# Altium project Wideband.PrjPCB
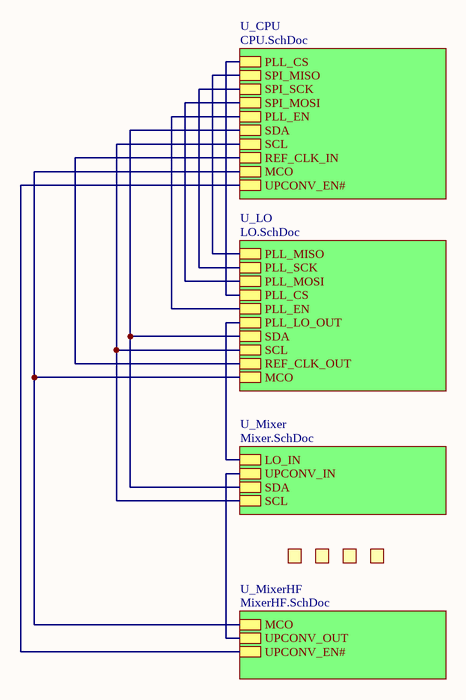
[diagram p0: Toplevel.SchDoc]
5 sheets, 175 parts. Net scope: hierarchical (ports join the sheet entries above them; power ports are global).
Board file: PCB.PcbDoc
Sheets:
  Toplevel.SchDoc
    U_CPU = CPU.SchDoc
    U_Mixer = Mixer.SchDoc
    U_MixerHF = MixerHF.SchDoc
    U_LO = LO.SchDoc

## Sheet Toplevel.SchDoc
size A4

### Parts
H1  MOUNTHOLE_3MM  [MOUNT_3MM]  (value not drawn)
H2  MOUNTHOLE_3MM  [MOUNT_3MM]  (value not drawn)
H3  MOUNTHOLE_3MM  [MOUNT_3MM]  (value not drawn)
H4  MOUNTHOLE_3MM  [MOUNT_3MM]  (value not drawn)

### Sub-sheets
U_CPU = CPU.SchDoc: PLL_CS, SPI_MISO, SPI_SCK, SPI_MOSI, PLL_EN, SDA, SCL, REF_CLK_IN, MCO, UPCONV_EN#
U_LO = LO.SchDoc: PLL_MISO, PLL_SCK, PLL_MOSI, PLL_CS, PLL_EN, PLL_LO_OUT, SDA, SCL, REF_CLK_OUT, MCO
U_Mixer = Mixer.SchDoc: LO_IN, UPCONV_IN, SDA, SCL
U_MixerHF = MixerHF.SchDoc: MCO, UPCONV_OUT, UPCONV_EN#

### Nets
CS_PLL: sheet U_CPU/PLL_CS, sheet U_LO/PLL_CS
LO+: sheet U_Mixer/LO_IN, sheet U_LO/PLL_LO_OUT
MOSI: sheet U_CPU/SPI_MOSI, sheet U_LO/PLL_MOSI
MUXOUT: sheet U_CPU/SPI_MISO, sheet U_LO/PLL_MISO
SCK: sheet U_CPU/SPI_SCK, sheet U_LO/PLL_SCK
SCL: sheet U_CPU/SCL, sheet U_Mixer/SCL, sheet U_LO/SCL
SDA: sheet U_CPU/SDA, sheet U_Mixer/SDA, sheet U_LO/SDA
NetC77_2: sheet U_Mixer/UPCONV_IN, sheet U_MixerHF/UPCONV_OUT
NetC83_2: sheet U_CPU/MCO, sheet U_MixerHF/MCO, sheet U_LO/MCO
NetR6_7: sheet U_CPU/PLL_EN, sheet U_LO/PLL_EN
NetR18_2: sheet U_CPU/REF_CLK_IN, sheet U_LO/REF_CLK_OUT
NetR33_1: sheet U_CPU/UPCONV_EN#, sheet U_MixerHF/UPCONV_EN#

## Sheet CPU.SchDoc
size A4
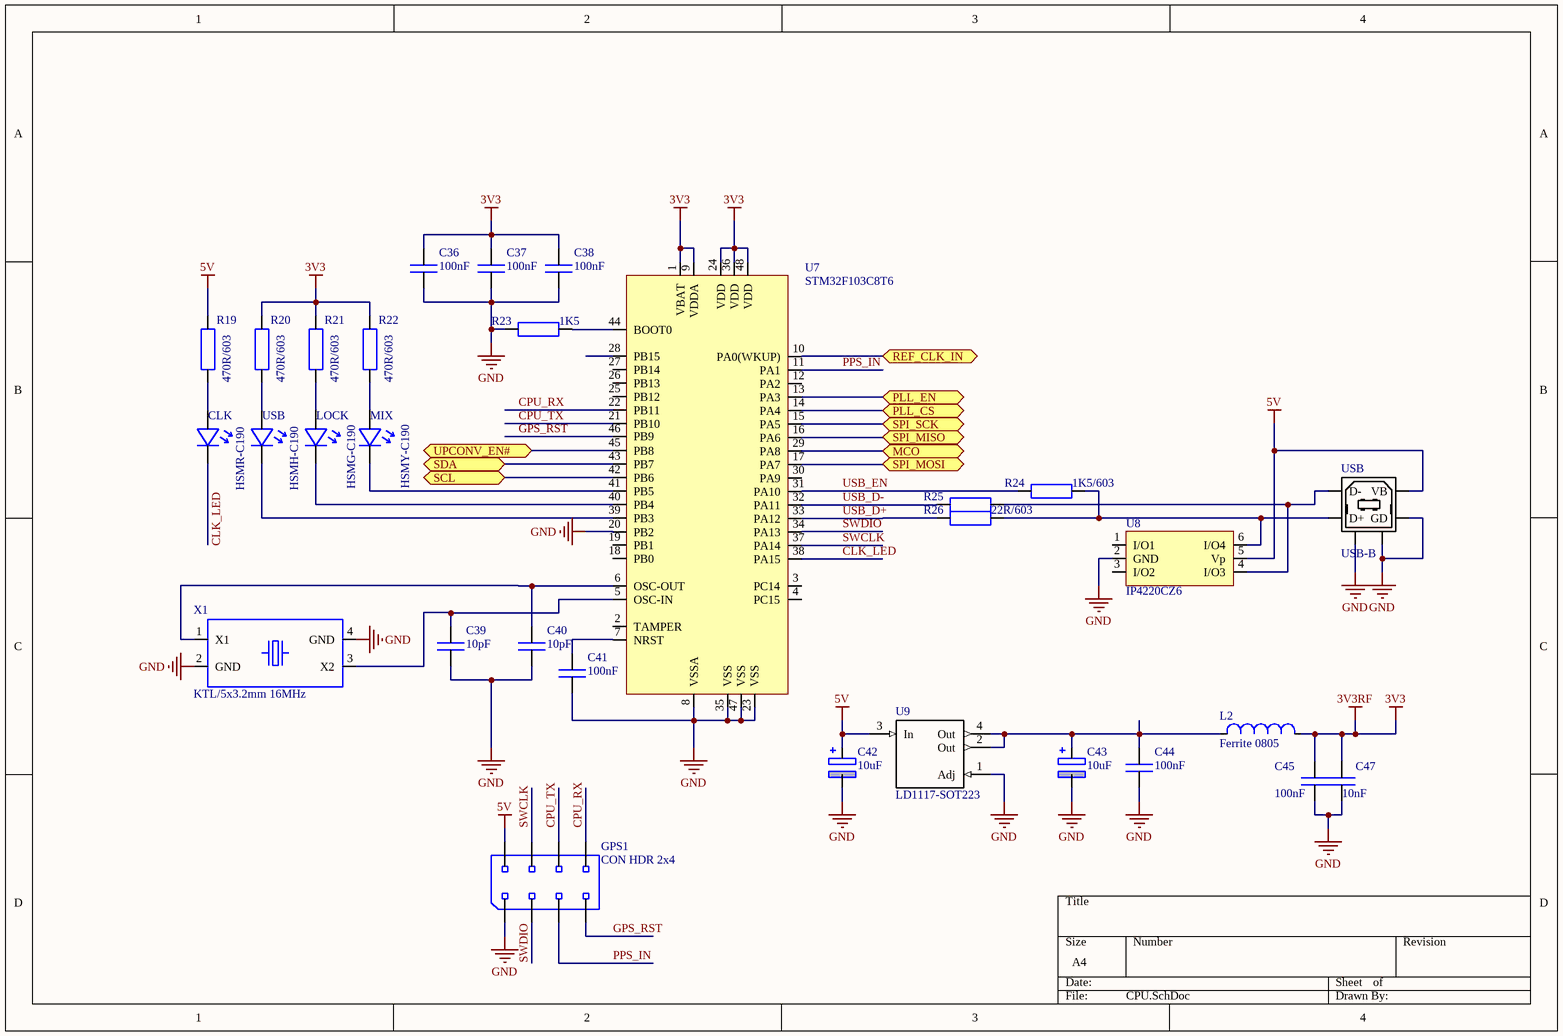
[diagram p1: CPU.SchDoc]

### Parts
(Parts that share a designator on the sheet are numbered #1, #2 ... from top to bottom, then left to right.)
C36  100nF  [smd C0603_0.80]
C37  100nF  [smd C0603_0.80]
C38  100nF  [smd C0603_0.80]
C39  10pF  [smd C0603_0.80]
C40  10pF  [smd C0603_0.80]
C41  100nF  [smd C0603_0.80]
C42  10uF  [smd C1206 polar]
C43  10uF  [smd C1206 polar]
C44  100nF  [smd C0603_0.80]
C45  100nF  [smd C0603_0.80]
C47  10nF  [smd C0603_0.80]
CLK  HSMR-C190  [led HSMH-C190 (Avago Technologies)]
GPS1  CON HDR 2x4  [hdr 2x4]
L2  Ferrite 0805  [smd C0805]
LOCK  HSMG-C190  [led HSMH-C190 (Avago Technologies)]
MIX  HSMY-C190  [led HSMH-C190 (Avago Technologies)]
R19  470R/603  [smd C0603_0.45]
R20  470R/603  [smd C0603_0.45]
R21  470R/603  [smd C0603_0.45]
R22  470R/603  [smd C0603_0.45]
R23  1K5  [smd C0603_0.45]
R24  1K5/603  [smd C0603_0.45]
R25  22R/603  [smd C0603_0.45]  (value not drawn)
R26  22R/603  [smd C0603_0.45]
U7  STM32F103C8T6  [TSQFP50P900X900X160-48N]
U8  IP4220CZ6  [smd SOT-457]
U9  LD1117-SOT223  [SOT223]
USB#1  HSMH-C190  [led HSMH-C190 (Avago Technologies)]
USB#2  USB-B  [USB-B]
X1#1  KTL/5x3.2mm 16MHz  [smd KTL 5x3.2]

### Ports
MCO, PLL_CS, PLL_EN, REF_CLK_IN, SCL, SDA, SPI_MISO, SPI_MOSI, SPI_SCK, UPCONV_EN#

### Nets
3V3: C36.2 C37.2 C38.2 C45.2 C47.2 L2.2 R20.2 R21.2 R22.2 U7.1(VBAT) U7.9(VDDA) U7.24(VDD) U7.36(VDD) U7.48(VDD)  [also labelled 3V3RF]
5V: C42.1 GPS1.2 R19.2 U8.5(Vp) U9.3(In) USB#2.1(VB)
GND: C36.1 C37.1 C38.1 C39.1 C40.1 C41.1 C42.2 C43.2 C44.1 C45.1 C47.1 GPS1.1 R23.1 U7.8(VSSA) U7.20(PB2) U7.23(VSS) U7.35(VSS) U7.47(VSS) U8.2(GND) U9.1(Adj) USB#2.4(GD) USB#2.5 USB#2.6 X1#1.2(GND) X1#1.4(GND)
CLK_LED: CLK.2 U7.38(PA15)
CPU_RX: GPS1.8 U7.22(PB11)
CPU_TX: GPS1.6 U7.21(PB10)
CS_PLL: U7.14(PA4) ; port PLL_CS
GPS_RST: GPS1.7 U7.46(PB9)
MOSI: U7.17(PA7) ; port SPI_MOSI
MUXOUT: U7.16(PA6) ; port SPI_MISO
PPS_IN: GPS1.5 U7.11(PA1)
SCK: U7.15(PA5) ; port SPI_SCK
SCL: U7.42(PB6) ; port SCL
SDA: U7.43(PB7) ; port SDA
SWCLK: GPS1.4 U7.37(PA14)
SWDIO: GPS1.3 U7.34(PA13)
USB_D+: R26.1 U7.33(PA12)
USB_D-: R25.1 U7.32(PA11)
USB_EN: R24.1 U7.31(PA10)
NetC39_2: C39.2 U7.5(OSC-IN) X1#1.3(X2)
NetC40_2: C40.2 U7.6(OSC-OUT) X1#1.1(X1)
NetC41_2: C41.2 U7.7(NRST)
NetC43_1: C43.1 C44.2 L2.1 U9.2(Out) U9.4(Out)
NetC83_2: U7.29(PA8) ; port MCO
NetCLK_1: CLK.1 R19.1
NetLOCK_1: LOCK.1 R21.1
NetLOCK_2: LOCK.2 U7.40(PB4)
NetMIX_1: MIX.1 R22.1
NetMIX_2: MIX.2 U7.41(PB5)
NetR6_7: U7.13(PA3) ; port PLL_EN
NetR18_2: U7.10(PA0(WKUP)) ; port REF_CLK_IN
NetR20_1: R20.1 USB#1.1
NetR23_2: R23.2 U7.44(BOOT0)
NetR24_2: R24.2 R26.2 U8.6(I/O4) USB#2.3(D+)
NetR25_2: R25.2 U8.4(I/O3) USB#2.2(D-)
NetR33_1: U7.45(PB8) ; port UPCONV_EN#
NetU7_39: U7.39(PB3) USB#1.2

Not connected (* = marked no-connect by the designer): U7 2(TAMPER) 3(PC14) 4(PC15) 12(PA2) 18(PB0) 19(PB1) 25(PB12) 26(PB13) 27(PB14) 28(PB15) 30(PA9); U8 1(I/O1) 3(I/O2)

### Library data of the parts
C36-C38 C41 C44 C45 C47 = CSMD603/100nF: smd capaciteit, verp.0603, 100nF; Part Number: CSMD603/100nF; Component Kind: Standard; Component Type: Standard; Designator: CSMD603/100nF; Pin Count: 2; Supplier 1: Farnell
C39 C40 = CSMD603/10pF: smd capaciteit, verp.0603, 10pF; Part Number: CSMD603/10pF; Component Kind: Standard; Component Type: Standard; Designator: CSMD603/10pF; Pin Count: 2; Supplier 1: Farnell
C42 C43 = CSMD1206/10uF/10V: smd capaciteit, tantalium, verp.1206, 10uF/10V; Part Number: CSMD1206/10uF/10V; Component Kind: Standard; Component Type: Standard; Designator: CSMD1206/10uF/10V; Pin Count: 2; Supplier 1: Farnell
CLK USB#1 = HSMH-C190: led smd rood, Avago Techn., HSMH-C190; Supplier 1: Farnell
GPS1 = CON HDR 2x4: pcb header recht 2x4  pitch 100mil; Part Number: CON HDR 2x4; Component Kind: Standard; Component Type: Standard; Designator: CON HDR 2x4; Pin Count: 8; Supplier 1: Farnell
L2 = Ferrite 0805: Ferrite bead, 0805 package; Supplier 1: Farnell
LOCK = HSMG-C190: led smd groen, Avago Techn., HSMG-C190; Supplier 1: Farnell
MIX = HSMY-C190: led smd geel, Avago Techn., HSMY-C190; Supplier 1: Farnell
R19-R22 = 470R/603: weerstand SMD603, 470R; Supplier 1: Farnell
R23 R24 = 1K5/603: weerstand SMD603, 1K5; Supplier 1: Farnell
R25 R26 = 22R/603: weerstand SMD603, 22R; Supplier 1: Farnell
U7 = STM32F100xx
U8 = IP4220CZ6: Dual USB 2.0 integrated ESD protection; Supplier 1: Farnell
USB#2 = USB-B: USB B DEVICE CONNECTOR; Text Field1: Assmann; Text Field2: AU-Y1007; Text Field3: Digi-Key; Text Field4: AE1085-ND; Text Field5: Thru-Hole; Text Field6: 1.168; NI?: *; O?: *; Section:: *
X1#1 = KTL/5x3.2mm 16MHz: TXC Xtal 16.000 MHz, 5x3.2mm; Part Number: KTL/5x3.2mm 16MHz; Component Kind: Standard; Component Type: Standard; Designator: KTL/5x3.2mm 16MHz; Pin Count: 4; Supplier 1: Farnell

## Sheet Mixer.SchDoc
size A3
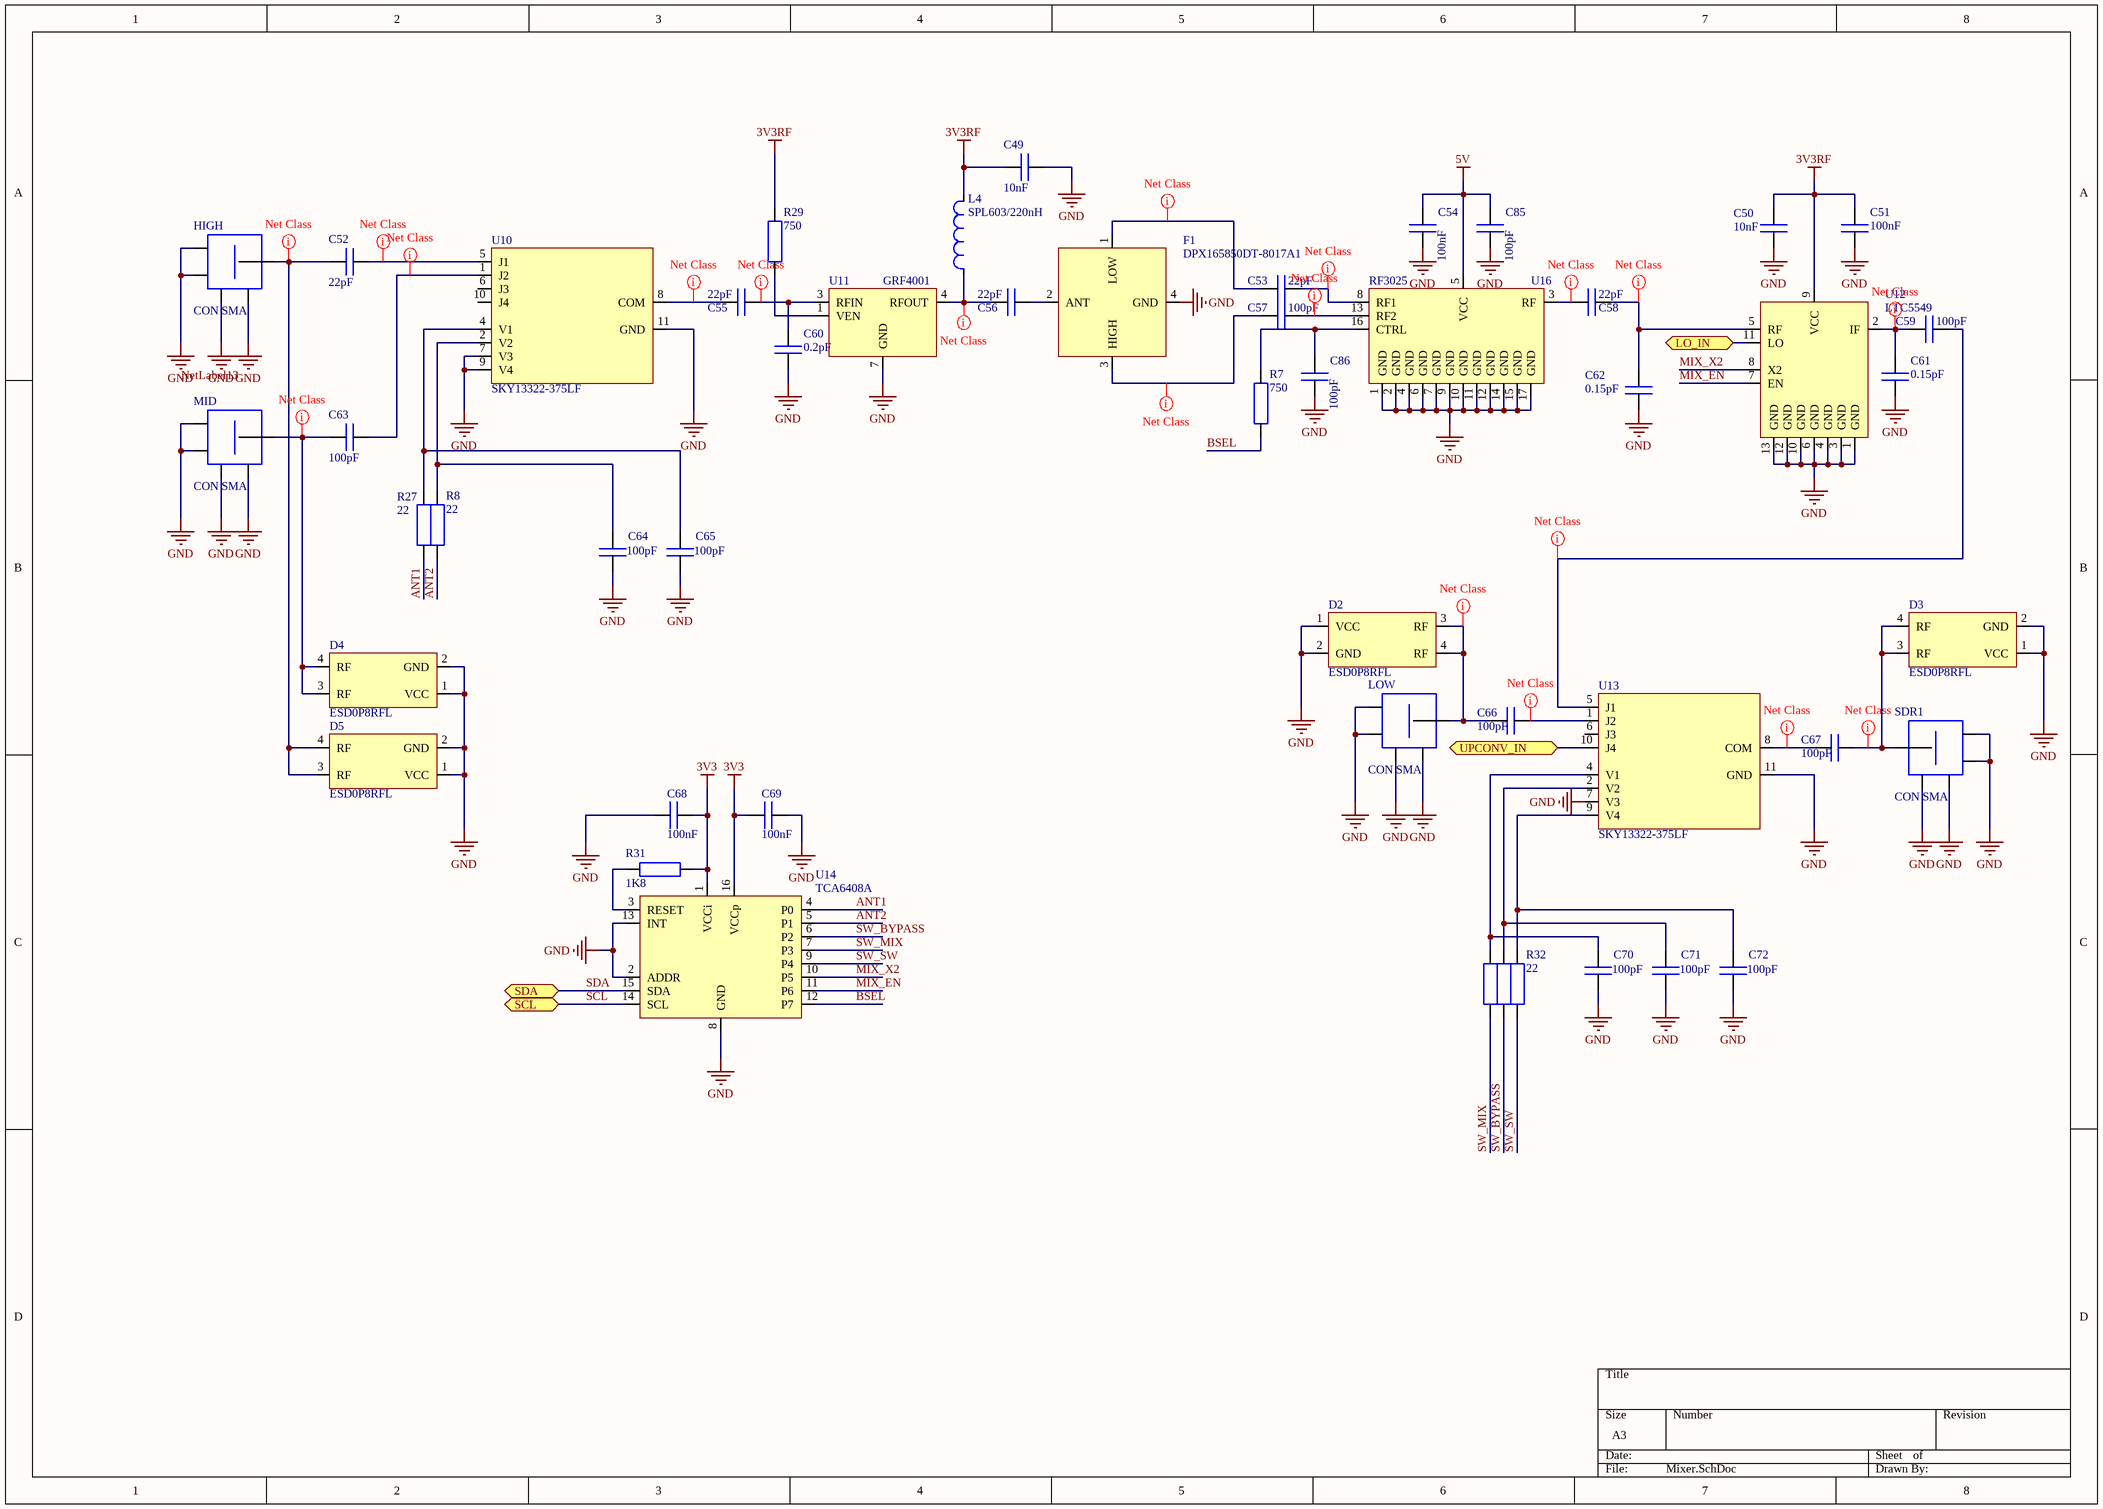
[diagram p2: Mixer.SchDoc]

### Parts
C49  10nF  [smd C0402]
C50  10nF  [smd C0402]
C51  100nF  [smd C0603_0.80]
C52  22pF  [smd C0402]
C53  22pF  [smd C0402]
C54  100nF  [smd C0603_0.80]
C55  22pF  [smd C0402]
C56  22pF  [smd C0402]
C57  100pF  [smd C0402]
C58  22pF  [smd C0402]
C59  100pF  [smd C0402]
C60  0.2pF  [smd C0402]
C61  0.15pF  [smd C0402]
C62  0.15pF  [smd C0402]
C63  100pF  [smd C0402]
C64  100pF  [smd C0603_0.80]
C65  100pF  [smd C0603_0.80]
C66  100pF  [smd C0402]
C67  100pF  [smd C0402]
C68  100nF  [smd C0603_0.80]
C69  100nF  [smd C0603_0.80]
C70  100pF  [smd C0603_0.80]
C71  100pF  [smd C0603_0.80]
C72  100pF  [smd C0603_0.80]
C85  100pF  [smd C0603_0.80]
C86  100pF  [smd C0603_0.80]
D2  ESD0P8RFL  [ESD0P8RFL]
D3  ESD0P8RFL  [ESD0P8RFL]
D4  ESD0P8RFL  [ESD0P8RFL]
D5  ESD0P8RFL  [ESD0P8RFL]
F1  DPX165850DT-8017A1  [DPX165850DT-8017A1]
HIGH  CON SMA  [con SMA (recht)]
L4  SPL603/220nH  [smd C0603]
LOW  CON SMA  [con SMA (recht)]
MID  CON SMA  [con SMA (recht)]
R7  750  [smd C0603_0.45]
R8  22  [smd C0603_0.45]
R27  22  [smd C0603_0.45]
R28  22  [smd C0603_0.45]  (value not drawn)
R29  750  [smd C0603_0.45]
R30  22  [smd C0603_0.45]  (value not drawn)
R31  1K8  [smd C0805_0.50]
R32  22  [smd C0603_0.45]
SDR1  CON SMA  [con SMA (recht)]
U10  SKY13322-375LF  [QFN50P200X300X80-10N]
U11  GRF4001  [GRF4001]
U12  LTC5549  [LTC5549]
U13  SKY13322-375LF  [QFN50P200X300X80-10N]
U14  TCA6408A  [TSOP65P640X100-16M]
U16  RF3025  [QFN50P300X300X100-16N]

### Ports
LO_IN, SCL, SDA, UPCONV_IN

### Nets
3V3: C49.2 C50.2 C51.2 C68.2 C69.1 L4.2 R29.2 R31.1 U12.9(VCC) U14.1(VCCi) U14.16(VCCp)  [also labelled 3V3RF]
5V: C54.2 C85.2 U16.5(VCC)
GND: C49.1 C50.1 C51.1 C54.1 C60.1 C61.1 C62.1 C64.1 C65.1 C68.1 C69.2 C70.1 C71.1 C72.1 C85.1 C86.1 D2.1(VCC) D2.2(GND) D3.1(VCC) D3.2(GND) D4.1(VCC) D4.2(GND) D5.1(VCC) D5.2(GND) F1.4(GND) HIGH.2 HIGH.3 HIGH.4 HIGH.5 LOW.2 LOW.3 LOW.4 LOW.5 MID.2 MID.3 MID.4 MID.5 SDR1.2 SDR1.3 SDR1.4 SDR1.5 U10.7(V3) U10.9(V4) U10.11(GND) U11.7(GND) U12.1(GND) U12.3(GND) U12.4(GND) U12.6(GND) U12.10(GND) U12.12(GND) U12.13(GND) U13.7(V3) U13.11(GND) U14.2(ADDR) U14.8(GND) U14.13(INT) U16.1(GND) U16.2(GND) U16.4(GND) U16.6(GND) U16.7(GND) U16.9(GND) U16.10(GND) U16.11(GND) U16.12(GND) U16.14(GND) U16.15(GND) U16.17(GND)
ANT1: R27.2 U14.4(P0)
ANT2: R8.1 U14.5(P1)
BSEL: R7.1 U14.12(P7)
LO+: U12.11(LO) ; port LO_IN
MIX_EN: U12.7(EN) U14.11(P6)
MIX_X2: U12.8(X2) U14.10(P5)
SCL: U14.14(SCL) ; port SCL
SDA: U14.15(SDA) ; port SDA
SW_BYPASS: R30.1 U14.6(P2)
SW_MIX: R28.1 U14.7(P3)
SW_SW: R32.1 U14.9(P4)
NetC52_1: C52.1 U10.5(J1)
NetC52_2: C52.2 D5.3(RF) D5.4(RF) HIGH.1
NetC53_1: C53.1 F1.1(LOW)
NetC53_2: C53.2 U16.8(RF1)
NetC55_1: C55.1 U10.8(COM)
NetC55_2: C55.2 C60.2 U11.3(RFIN)
NetC56_1: C56.1 L4.1 U11.4(RFOUT)
NetC56_2: C56.2 F1.2(ANT)
NetC57_1: C57.1 F1.3(HIGH)
NetC57_2: C57.2 U16.13(RF2)
NetC58_1: C58.1 U16.3(RF)
NetC58_2: C58.2 C62.2 U12.5(RF)
NetC59_1: C59.1 C61.2 U12.2(IF)
NetC59_2: C59.2 U13.5(J1)
NetC63_1: C63.1 U10.1(J2)
NetC63_2: C63.2 D4.3(RF) D4.4(RF) MID.1
NetC64_2: C64.2 R8.2 U10.2(V2)
NetC65_2: C65.2 R27.1 U10.4(V1)
NetC66_1: C66.1 D2.3(RF) D2.4(RF) LOW.1
NetC66_2: C66.2 U13.1(J2)
NetC67_1: C67.1 U13.8(COM)
NetC67_2: C67.2 D3.3(RF) D3.4(RF) SDR1.1
NetC70_2: C70.2 R28.2 U13.4(V1)
NetC71_2: C71.2 R30.2 U13.2(V2)
NetC72_2: C72.2 R32.2 U13.9(V4)
NetC77_2: U13.10(J4) ; port UPCONV_IN
NetC86_2: C86.2 R7.2 U16.16(CTRL)
NetR29_1: R29.1 U11.1(VEN)
NetR31_2: R31.2 U14.3(RESET)

Not connected (* = marked no-connect by the designer): U10 6(J3) 10(J4); U13 6(J3)

### Layout directives
net class RF: NetC52_1, NetC52_2, NetC53_1, NetC53_2, NetC55_1, NetC55_2, NetC56_1, NetC57_1, NetC57_2, NetC58_1, NetC58_2, NetC59_1, NetC59_2, NetC63_1, NetC63_2, NetC66_1, NetC66_2, NetC67_1, NetC67_2

### Notes on the sheet
- Labels drawn without touching a wire or pin: NetLabel13

### Library data of the parts
C49 C50 = CSMD402/100nF: smd capaciteit, verp.0402, 10nF; Part Number: CSMD402/100nF; Component Kind: Standard; Component Type: Standard; Designator: CSMD402/100nF; Pin Count: 2; Supplier 1: Farnell
C51 C54 C68 C69 = CSMD603/100nF: smd capaciteit, verp.0603, 100nF; Part Number: CSMD603/100nF; Component Kind: Standard; Component Type: Standard; Designator: CSMD603/100nF; Pin Count: 2
  C51 C54: Supplier 1: Farnell
C52 C53 C55-C63 C66 C67 = CSMD402/22pF: smd capaciteit, verp.0402, 22pF; Part Number: CSMD402/22pF; Component Kind: Standard; Component Type: Standard; Designator: CSMD402/22pF; Pin Count: 2; Supplier 1: Farnell
C64 C65 C70-C72 C85 C86 = CSMD603/100pF: smd capaciteit, verp.0603, 100pF; Part Number: CSMD603/100pF; Component Kind: Standard; Component Type: Standard; Designator: CSMD603/100pF; Pin Count: 2; Supplier 1: Farnell
HIGH LOW MID SDR1 = CON SMA: SMA connector, rechtop; Part Number: CON SMA; Component Kind: Standard; Component Type: Standard; Designator: CON SMA; Pin Count: 5; Supplier 1: Farnell
R7 R8 R27-R30 R32 = 750R/603: weerstand SMD603, 750R; Supplier 1: Farnell
R31 = 1K8/805: weerstand SMD805, 1K8
L4 = SPL603/220nH: Component Kind: Standard; Supplier 1: Farnell

## Sheet MixerHF.SchDoc
size A4
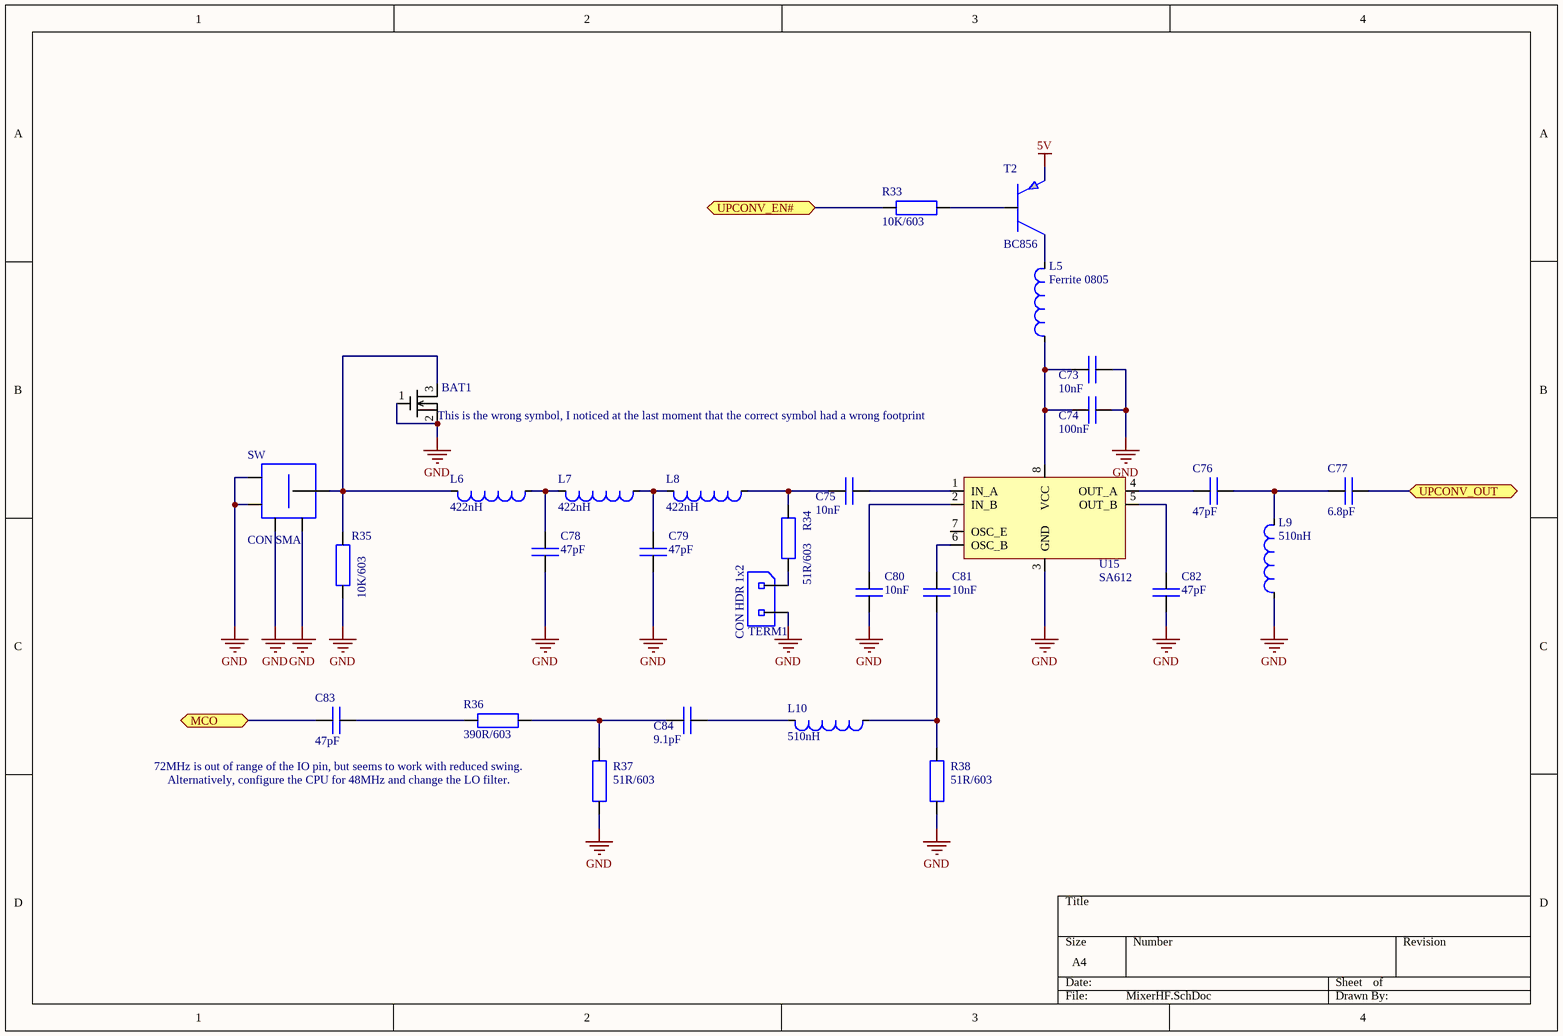
[diagram p3: MixerHF.SchDoc]

### Parts
BAT1  (no value)  [SOT95P230X110-3N]
C73  10nF  [smd C0603_0.80]
C74  100nF  [smd C0603_0.80]
C75  10nF  [smd C0603_0.80]
C76  47pF  [smd C0603_0.80]
C77  6.8pF  [smd C0603_0.80]
C78  47pF  [smd C0603_0.80]
C79  47pF  [smd C0603_0.80]
C80  10nF  [smd C0603_0.80]
C81  10nF  [smd C0603_0.80]
C82  47pF  [smd C0603_0.80]
C83  47pF  [smd C0603_0.80]
C84  9.1pF  [smd C0603_0.80]
L5  Ferrite 0805  [smd C0805]
L6  422nH  [smd C0805]
L7  422nH  [smd C0805]
L8  422nH  [smd C0805]
L9  510nH  [smd C0805]
L10  510nH  [smd C0805]
R33  10K/603  [smd C0603_0.45]
R34  51R/603  [smd C0603_0.45]
R35  10K/603  [smd C0603_0.45]
R36  390R/603  [smd C0603_0.45]
R37  51R/603  [smd C0603_0.45]
R38  51R/603  [smd C0603_0.45]
SW  CON SMA  [con SMA (recht)]
T2  BC856  [smd SOT-23]
TERM1  CON HDR 1x2  [hdr 1x2]
U15  SA612  [SOIC127P600X175-8N]

### Ports
MCO, UPCONV_EN#, UPCONV_OUT

### Nets
5V: T2.2
GND: BAT1.1(G) BAT1.2(S) C73.1 C74.1 C78.1 C79.1 C80.2 C82.1 L9.1 R35.1 R37.2 R38.2 SW.2 SW.3 SW.4 SW.5 TERM1.2 U15.3(GND)
NetBAT1_3: BAT1.3(D) L6.2 R35.2 SW.1
NetC73_2: C73.2 C74.2 L5.1 U15.8(VCC)
NetC75_1: C75.1 U15.1(IN_A)
NetC75_2: C75.2 L8.1 R34.2
NetC76_1: C76.1 U15.4(OUT_A)
NetC76_2: C76.2 C77.1 L9.2
NetC77_2: C77.2 ; port UPCONV_OUT
NetC78_2: C78.2 L6.1 L7.2
NetC79_2: C79.2 L7.1 L8.2
NetC80_1: C80.1 U15.2(IN_B)
NetC81_1: C81.1 U15.6(OSC_B)
NetC81_2: C81.2 L10.1 R38.1
NetC82_2: C82.2 U15.5(OUT_B)
NetC83_1: C83.1 R36.2
NetC83_2: C83.2 ; port MCO
NetC84_1: C84.1 L10.2
NetC84_2: C84.2 R36.1 R37.1
NetL5_2: L5.2 T2.3
NetR33_1: R33.1 ; port UPCONV_EN#
NetR33_2: R33.2 T2.1
NetR34_1: R34.1 TERM1.1

Not connected (* = marked no-connect by the designer): U15 7(OSC_E)

### Notes on the sheet
- (near BAT1) This is the wrong symbol, I noticed at the last moment that the correct symbol had a wrong footprint
- (near R37) 72MHz is out of range of the IO pin, but seems to work with reduced swing.
- (near R37) Alternatively, configure the CPU for 48MHz and change the LO filter.

### Library data of the parts
BAT1 = NX3008NBK
C73-C75 C80 C81 C84 = CSMD603/100nF: smd capaciteit, verp.0603, 100nF; Part Number: CSMD603/100nF; Component Kind: Standard; Component Type: Standard; Designator: CSMD603/100nF; Pin Count: 2; Supplier 1: Farnell
C76-C79 C82 C83 = CSMD603/10pF: smd capaciteit, verp.0603, 10pF; Part Number: CSMD603/10pF; Component Kind: Standard; Component Type: Standard; Designator: CSMD603/10pF; Pin Count: 2; Supplier 1: Farnell
L5 = Ferrite 0805: Ferrite bead, 0805 package; Supplier 1: Farnell
L6-L10 = SPL805/250nH: smd spoel, verpakking 805, 250nH; Component Kind: Standard; Supplier 1: Farnell
R33 R35 = 10K/603: weerstand SMD603, 10K; Supplier 1: Farnell
R34 R37 R38 = 51R/603: weerstand SMD603, 51R; Supplier 1: Farnell
R36 = 390R/603: weerstand SMD603, 390R; Supplier 1: Farnell
SW = CON SMA: SMA connector, rechtop; Part Number: CON SMA; Component Kind: Standard; Component Type: Standard; Designator: CON SMA; Pin Count: 5; Supplier 1: Farnell
T2 = BC856: PNP transistor, smd; Supplier 1: Farnell
TERM1 = CON HDR 1x2: pcb header recht 1x2  pitch 100mil; Part Number: CON HDR 1x2; Component Kind: Standard; Component Type: Standard; Designator: CON HDR 1x2; Pin Count: 2; Supplier 1: Farnell

## Sheet LO.SchDoc
size A4
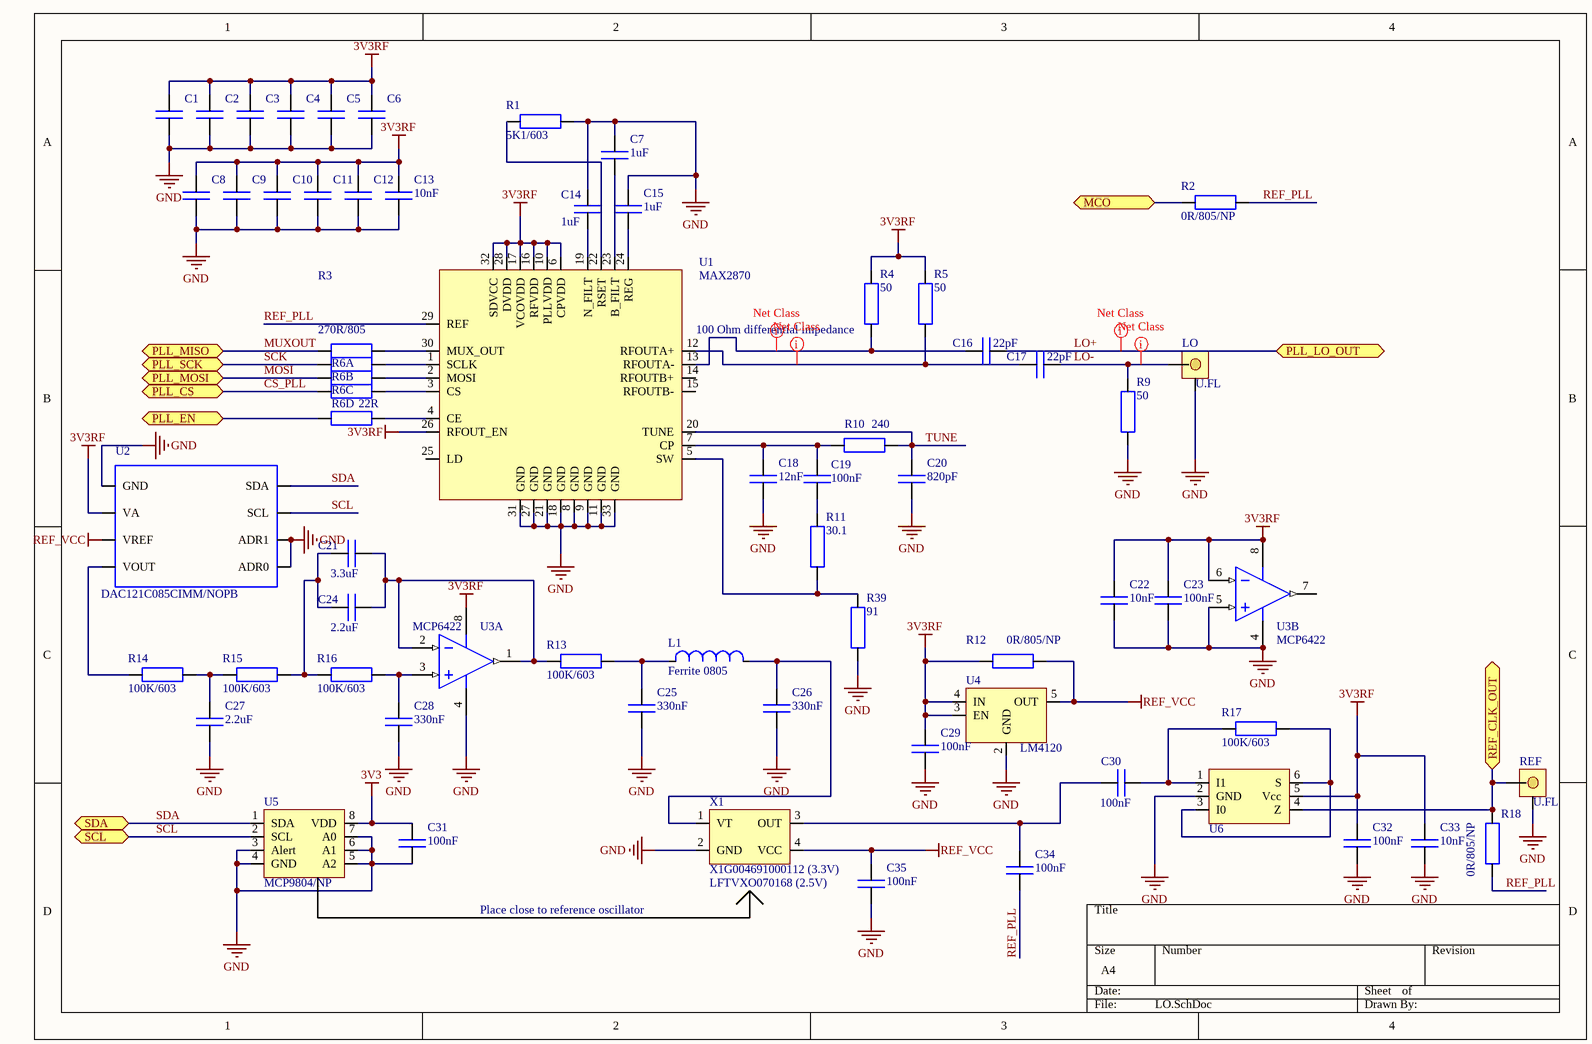
[diagram p4: LO.SchDoc]

### Parts
(Parts that share a designator on the sheet are numbered #1, #2 ... from top to bottom, then left to right.)
C1  100nF  [smd C0603_0.80]  (value not drawn)
C2  100nF  [smd C0603_0.80]  (value not drawn)
C3  100nF  [smd C0603_0.80]  (value not drawn)
C4  100nF  [smd C0603_0.80]  (value not drawn)
C5  100nF  [smd C0603_0.80]  (value not drawn)
C6  100nF  [smd C0603_0.80]  (value not drawn)
C7  1uF  [smd C0603_0.80]
C8  10nF  [smd C0402]  (value not drawn)
C9  10nF  [smd C0402]  (value not drawn)
C10  10nF  [smd C0402]  (value not drawn)
C11  10nF  [smd C0402]  (value not drawn)
C12  10nF  [smd C0402]  (value not drawn)
C13  10nF  [smd C0402]
C14  1uF  [smd C0603_0.80]
C15  1uF  [smd C0603_0.80]
C16  22pF  [smd C0402]
C17  22pF  [smd C0402]
C18  12nF  [smd C0603_0.80]
C19  100nF  [smd C0603_0.80]
C20  820pF  [smd C0603_0.80]
C21  3.3uF  [smd C0805_1.30]
C22  10nF  [smd C0402]
C23  100nF  [smd C0603_0.80]
C24  2.2uF  [smd C0805_1.30]
C25  330nF  [smd C0805_0.60]
C26  330nF  [smd C0805_0.60]
C27  2.2uF  [smd C0805_1.30]
C28  330nF  [smd C0805_0.60]
C29  100nF  [smd C0603_0.80]
C30  100nF  [smd C0603_0.80]
C31  100nF  [smd C0603_0.80]
C32  100nF  [smd C0603_0.80]
C33  10nF  [smd C0603_0.80]
C34  100nF  [smd C0603_0.80]
C35  100nF  [smd C0603_0.80]
L1  Ferrite 0805  [smd C0805]
LO  U.FL  [smd U.FL]
R1  5K1/603  [smd C0603_0.45]
R2  0R/805/NP  [smd C0805_0.50]
R3  270R/805  [smd C0805_0.50]
R4  50  [smd C0402_0.35]
R5  50  [smd C0402_0.35]
R6  22R  [smd R EXB38v]  (value not drawn)  (parts A,B,C,D of 4)
R9  50  [smd C0402_0.35]
R10  240  [smd C0603_0.45]
R11  30.1  [smd C0603_0.45]
R12  0R/805/NP  [smd C0805_0.50]
R13  100K/603  [smd C0603_0.45]
R14  100K/603  [smd C0603_0.45]
R15  100K/603  [smd C0603_0.45]
R16  100K/603  [smd C0603_0.45]
R17  100K/603  [smd C0603_0.45]
R18  0R/805/NP  [smd C0805_0.50]
R39  91  [smd C0603_0.45]
REF  U.FL  [smd U.FL]
U1  MAX2870  [MAXIM-T3255]
U2  DAC121C085CIMM/NOPB  [smd MSOP/8]
U3  MCP6422  [smd soicn/8]  (parts A,B of 2)
U4  LM4120  [SO23-5 TI]
U5  MCP9804/NP  [smd MSOP/8]
U6  NC7WZU04  [SMD SC-70 (6-pin)]  (value not drawn)
X1#2  X1G004691000112 (3.3V)  [X1G004691000112]

### Ports
MCO, PLL_CS, PLL_EN, PLL_LO_OUT, PLL_MISO, PLL_MOSI, PLL_SCK, REF_CLK_OUT, SCL, SDA

### Nets
3V3: C1.2 C2.2 C3.2 C4.2 C5.2 C6.2 C8.2 C9.2 C10.2 C11.2 C12.2 C13.2 C22.2 C23.2 C29.2 C31.2 C32.2 C33.2 R4.2 R5.2 R12.1 U1.6(CPVDD) U1.10(PLLVDD) U1.16(RFVDD) U1.17(VCOVDD) U1.26(RFOUT_EN) U1.28(DVDD) U1.32(SDVCC) U2.6(VA) U3.6(IN-) U3.8(V+) U4.3(EN) U4.4(IN) U5.8(VDD) U6.5(Vcc)  [also labelled 3V3RF]
GND: C1.1 C2.1 C3.1 C4.1 C5.1 C6.1 C7.1 C8.1 C9.1 C10.1 C11.1 C12.1 C13.1 C14.1 C15.1 C18.1 C20.1 C22.1 C23.1 C25.1 C26.1 C27.1 C28.1 C29.1 C31.1 C32.1 C33.1 C35.1 LO.0 R1.1 R9.1 R39.1 REF.0 U1.8(GND) U1.9(GND) U1.11(GND) U1.18(GND) U1.21(GND) U1.27(GND) U1.31(GND) U1.33(GND) U2.1(ADR0) U2.2(ADR1) U2.5(GND) U3.4(V-) U3.5(IN+) U4.2(GND) U5.3(Alert) U5.4(GND) U5.5(A2) U5.6(A1) U5.7(A0) U6.2(GND) X1#2.2(GND)
REF_VCC: C35.2 R12.2 U2.7(VREF) U4.5(OUT) X1#2.4(VCC)
CS_PLL: R6.5 ; port PLL_CS
LO+: C16.2 ; port PLL_LO_OUT
LO-: C17.2 LO.1 R9.2
MOSI: R6.3 ; port PLL_MOSI
MUXOUT: R3.1 ; port PLL_MISO
REF_PLL: C34.2 R2.1 R18.1 U1.29(REF)
SCK: R6.1 ; port PLL_SCK
SCL: U2.3(SCL) U5.2(SCL) ; port SCL
SDA: U2.4(SDA) U5.1(SDA) ; port SDA
TUNE: C20.2 R10.2 U1.20(TUNE)
NetC7_2: C7.2 U1.23(B_FILT)
NetC14_2: C14.2 U1.19(N_FILT)
NetC15_2: C15.2 U1.24(REG)
NetC16_1: C16.1 R4.1 U1.13(RFOUTA-)
NetC17_1: C17.1 R5.1 U1.12(RFOUTA+)
NetC18_2: C18.2 C19.2 R10.1 U1.7(CP)
NetC19_1: C19.1 R11.2
NetC21_1: C21.1 C24.1 R13.1 U3.1(OUT) U3.2(IN-)
NetC21_2: C21.2 C24.2 R15.2 R16.1
NetC25_2: C25.2 L1.1 R13.2
NetC26_2: C26.2 L1.2 X1#2.1(VT)
NetC27_2: C27.2 R14.2 R15.1
NetC28_2: C28.2 R16.2 U3.3(IN+)
NetC30_1: C30.1 R17.1 U6.1(I1)
NetC30_2: C30.2 C34.1 X1#2.3(OUT)
NetC83_2: R2.2 ; port MCO
NetR1_2: R1.2 U1.22(RSET)
NetR3_2: R3.2 U1.30(MUX_OUT)
NetR6_2: R6.2 U1.1(SCLK)
NetR6_4: R6.4 U1.2(MOSI)
NetR6_6: R6.6 U1.3(CS)
NetR6_7: R6.7 ; port PLL_EN
NetR6_8: R6.8 U1.4(CE)
NetR11_1: R11.1 R39.2 U1.5(SW)
NetR14_1: R14.1 U2.8(VOUT)
NetR17_2: R17.2 U6.3(I0) U6.6(S)
NetR18_2: R18.2 REF.1 U6.4(Z) ; port REF_CLK_OUT

Not connected (* = marked no-connect by the designer): U1 14(RFOUTB+) 15(RFOUTB-) 25(LD); U3 7(OUT)

### Layout directives
net class RF: LO+, LO-, NetC16_1, NetC17_1

### Notes on the sheet
- (near R4) 100 Ohm differential impedance
- Place close to reference oscillator
- (near X1#2) LFTVXO070168 (2.5V)

### Library data of the parts
C1-C6 C23 C29-C35 = CSMD603/100nF: smd capaciteit, verp.0603, 100nF; Part Number: CSMD603/100nF; Component Kind: Standard; Component Type: Standard; Designator: CSMD603/100nF; Pin Count: 2; Supplier 1: Farnell
C7 C14 C15 = CSMD603/1uF: smd capaciteit, verp.0603, 1uF; Part Number: CSMD603/18nF; Component Kind: Standard; Component Type: Standard; Designator: CSMD603/18nF; Library Reference: CSMD603/18nF; Pin Count: 2
C8-C13 C22 = CSMD402/100nF: smd capaciteit, verp.0402, 10nF; Part Number: CSMD402/100nF; Component Kind: Standard; Component Type: Standard; Designator: CSMD402/100nF; Pin Count: 2; Supplier 1: Farnell
C16 C17 = CSMD402/22pF: smd capaciteit, verp.0402, 22pF; Part Number: CSMD402/22pF; Component Kind: Standard; Component Type: Standard; Designator: CSMD402/22pF; Pin Count: 2; Supplier 1: Farnell
C18-C20 = CSMD603/12nF: smd capaciteit, verp.0603, 12nF; Part Number: CSMD603/12nF; Component Kind: Standard; Component Type: Standard; Designator: CSMD603/12nF; Pin Count: 2
C21 C24 C27 = CSMD805/1uF: smd capaciteit, verp.0805, 1uF
C25 C26 C28 = CSMD805/330nF: smd capaciteit, verp.0805, 330nF; Part Number: CSMD805/330nF; Component Kind: Standard; Component Type: Standard; Designator: CSMD805/330nF; Pin Count: 2
L1 = Ferrite 0805: Ferrite bead, 0805 package; Supplier 1: Farnell
LO REF = CON HRS/SMA/ U.FL-R-SMT(01): connector Hirose, U.FL serie, U.FL-R-SMT(01); Supplier 1: Farnell
R1 = 5K1/603: weerstand SMD603, 5K1
R2 R3 R12 R18 = 270R/805: weerstand SMD805, 270R
R4 R5 R9 = 47K/402: weerstand SMD402, 47K
R6 = 22R/Network4/603: weerstandsnetwerk SMD603, 4x 22R; Supplier 1: Farnell
R10 R11 R39 = 240K/603: weerstand SMD603, 240K
R13-R17 = 100K/603: weerstand SMD603, 100K; Supplier 1: Farnell
U2 = DAC081C085CIMM/NOPB: 12-Bit Micro Power DAC with I2C interface; Supplier 1: Farnell
U3 = MCP602-E/SN: Dual 2.7V to 6.0V Single Supply CMOS Op Amp
U5 = MCP9804: ±0.25°C Typical Accuracy Digital Temperature Sensor; Supplier 1: Farnell
U6 = NC7SV157P6X: TinyLogic  2-Input Non-Inverting Multiplexer
X1#2 = X1G004691000112

## Nets that join several sheets
3V3: CPU (14 pins), Mixer (11 pins), LO (35 pins)
5V: CPU (6 pins), Mixer (C54.2 C85.2 U16.5), MixerHF (T2.2)
GND: CPU (25 pins), Mixer (69 pins), MixerHF (18 pins), LO (54 pins)
CS_PLL: CPU (U7.14), LO (R6.5)
LO+: Mixer (U12.11), LO (C16.2)
MOSI: CPU (U7.17), LO (R6.3)
MUXOUT: CPU (U7.16), LO (R3.1)
NetC77_2: Mixer (U13.10), MixerHF (C77.2)
NetC83_2: CPU (U7.29), MixerHF (C83.2), LO (R2.2)
NetR6_7: CPU (U7.13), LO (R6.7)
NetR18_2: CPU (U7.10), LO (R18.2 REF.1 U6.4)
NetR33_1: CPU (U7.45), MixerHF (R33.1)
SCK: CPU (U7.15), LO (R6.1)
SCL: CPU (U7.42), Mixer (U14.14), LO (U2.3 U5.2)
SDA: CPU (U7.43), Mixer (U14.15), LO (U2.4 U5.1)